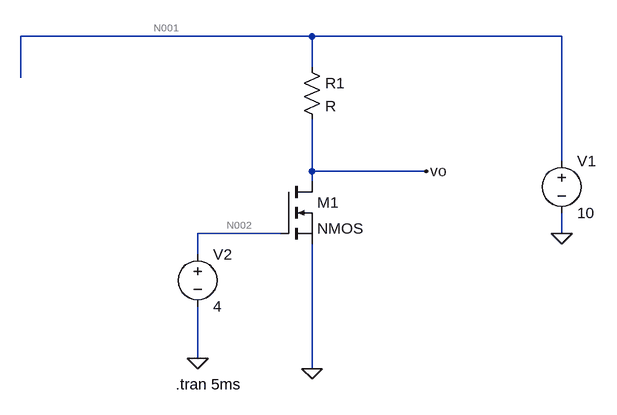
[diagram p0: schematic Draft5.asc]
Draft5.asc, the LTspice schematic file:
Version 4
SHEET 1 880 680
WIRE 176 -128 -272 -128
WIRE 560 -128 176 -128
WIRE 176 -80 176 -128
WIRE -272 -64 -272 -128
WIRE 560 64 560 -128
WIRE 176 80 176 0
WIRE 352 80 176 80
WIRE 176 96 176 80
WIRE 128 176 0 176
WIRE 560 176 560 144
WIRE 0 208 0 176
WIRE 0 368 0 288
WIRE 176 384 176 192
FLAG 0 368 0
FLAG 352 80 vo
FLAG 176 384 0
FLAG 560 176 0
SYMBOL nmos 128 96 R0
SYMATTR InstName M1
SYMBOL voltage 560 48 R0
WINDOW 123 0 0 Left 0
WINDOW 39 0 0 Left 0
SYMATTR InstName V1
SYMATTR Value 10
SYMBOL voltage 0 192 R0
SYMATTR InstName V2
SYMATTR Value 4
SYMBOL res 160 -96 R0
SYMATTR InstName R1
TEXT -34 408 Left 2 !.tran 5ms

The netlist it stands for:
* Draft5.asc
M1 vo N002 0 0 NMOS
V1 N001 0 10
V2 N002 0 4
R1 N001 vo R
.model NMOS NMOS
.model PMOS PMOS
.lib standard.mos
.tran 5ms
.backanno
.end

* Results of the author's LTspice run, read from the files saved beside the schematic
* Operating Point, zero values left out:
*   V(vo) = 9.918 V
*   V(n002) = 4 V
*   V(n001) = 10 V
*   Id(M1) = 160 µA
*   Ib(M1) = -9.928 pA
*   Is(M1) = -160 µA
*   I(R1) = 160 µA
*   I(V1) = -160 µA